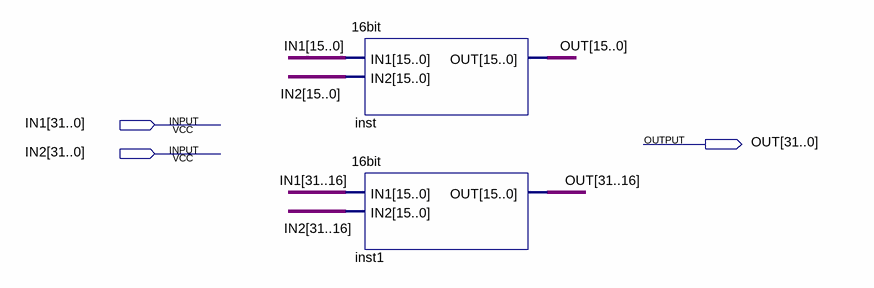
[diagram p0: schematic sheet]
// Quartus schematic 32bit.bdf as structural Verilog: 2 symbols, 3 pins
module \32bit  (
  input  [31:0] IN1,
  input  [31:0] IN2,
  output [31:0] OUT
);

  \16bit  inst (.IN1(IN1[15:0]), .IN2(IN2[15:0]), .OUT(OUT[15:0]));
  \16bit  inst1 (.IN1(IN1[31:16]), .IN2(IN2[31:16]), .OUT(OUT[31:16]));
endmodule
